# EAGLE design modular-main (EAGLE 9.2.2)
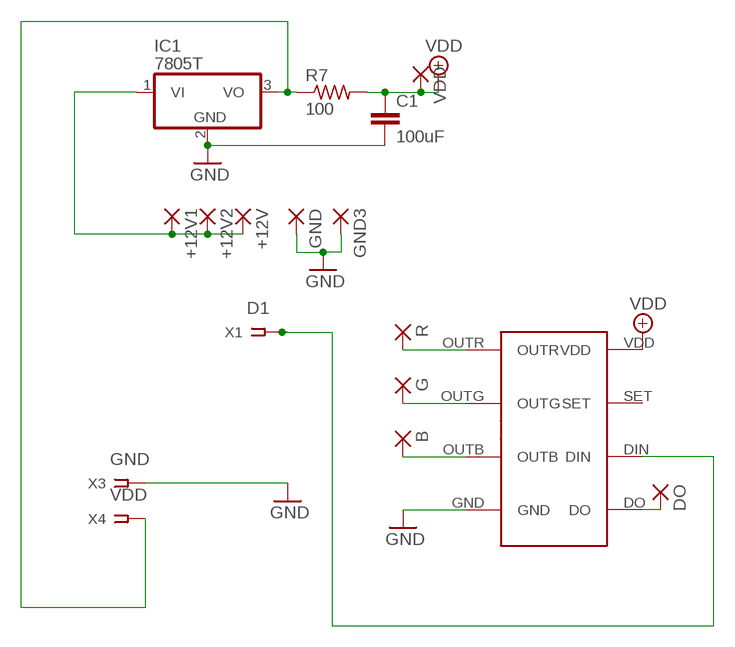
[diagram p0: schematic, sheet 1]

## Parts
0  WS2811  [SOP8]
+12V  SMD5  [SMD2,54-5,08]
+12V1  SMD5  [SMD2,54-5,08]
+12V2  SMD5  [SMD2,54-5,08]
B  SMD5  [SMD2,54-5,08]
C1  100uF  C-EUC0805  [C0805]
DO  SMD5  [SMD2,54-5,08]
G  SMD5  [SMD2,54-5,08]
GND  SMD5  [SMD2,54-5,08]
GND3  SMD5  [SMD2,54-5,08]
IC1  7805T  [TO220H]
R  SMD5  [SMD2,54-5,08]
R7  100  R-US_R0805  [R0805]
VDD  SMD5  [SMD2,54-5,08]
X1  D1  SSW-101-02-G-S  [SSW-101-02-G-S]
X3  GND  SSW-101-02-G-S  [SSW-101-02-G-S]
X4  VDD  SSW-101-02-G-S  [SSW-101-02-G-S]

## Nets
+5V: 0.VDD C1.1 R7.2 VDD.1(P) ; supply symbol labelled VDD
GND: 0.GND C1.2 GND3.1(P) GND.1(P) IC1.2(GND) X3.1
N$1: 0.DIN X1.1
N$2: 0.DO DO.1(P)
N$3: 0.OUTB B.1(P)
N$4: 0.OUTG G.1(P)
N$5: 0.OUTR R.1(P)
N$28: IC1.3(VO) R7.1 X4.1
N$29: +12V1.1(P) +12V2.1(P) +12V.1(P) IC1.1(VI)
Unconnected: 0.SET

## Library data of the parts
0 = ws2811:WS2811
+12V +12V1 +12V2 B DO G GND GND3 R VDD = wirepad:SMD5: SMD PAD
C1 = rcl:C-EU: CAPACITOR, European symbol; SPICEPREFIX: C
IC1 = linear:78*: Positive VOLTAGE REGULATOR Source: http://cache.national.com/ds/LM/LM78L05.pdf http://www.fairchildsemi.com/ds/LM/LM7805.pdf
R7 = rcl:R-US_: RESISTOR, American symbol; SPICEPREFIX: R
X1 X3 X4 = con-samtec:SSW-101-02-G-S: THROUGH-HOLE .025" SQ POST SOCKET Source: Samtec SSW.pdf; MF: Samtec Inc.; MPN: SSW-101-02-G-S; OC_FARNELL: unknown; OC_NEWARK: 11P9336

## Board
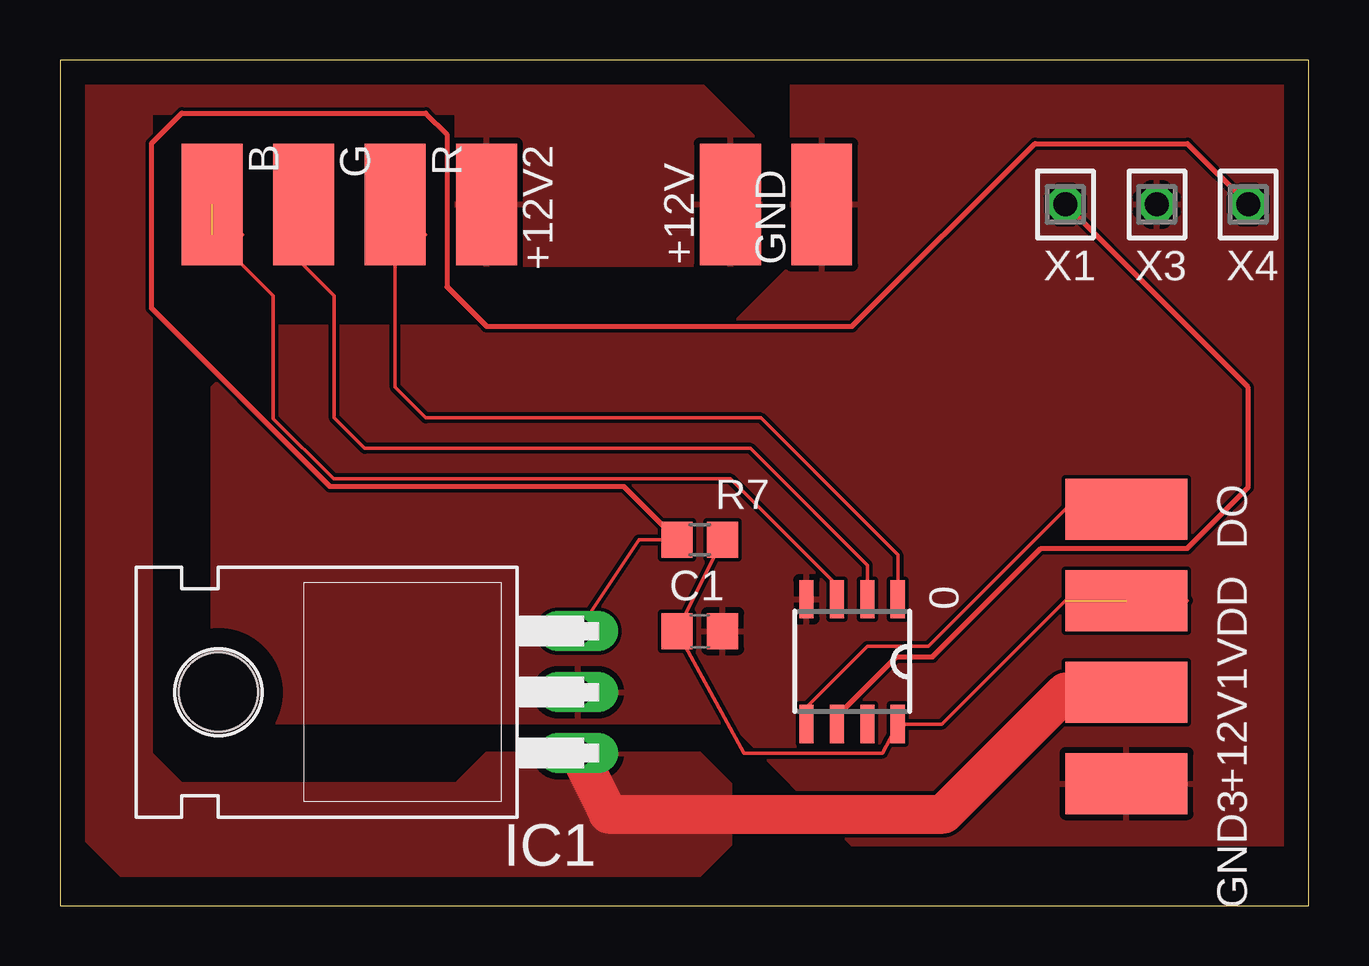
[diagram p1: board, top side]

Size 52.05 x 35.23 mm. Coordinates in mm from the lower left corner, seen from the top.
Outline: 0,0 52.05,0 52.05,35.23 0,35.23 0,0
Copper layers (1*16): Top 0.035mm / dielectric 1.5mm / Bottom 0.035mm
Design rules "default": minimum track width 6mil, minimum drill 0.35mm, track to track 6mil, track to pad 6mil, pad to pad 6mil, via to via 6mil, smd to smd 6mil, copper to edge 40mil, drill to drill 6mil, minimum pad ring 10mil, minimum via ring 8mil, stop-mask expansion 4mil, vias tented up to drill 0mil, thermal gap 10mil

### Footprints (pad centres in the part's own frame; a part is rotated, then mirrored left to right if it is on the bottom)
SOP8 = smd 0.6 x 1.6: DIN 0.635,2.6; DO 1.905,2.6; GND 1.905,-2.6; OUTB 0.635,-2.6; OUTG -0.635,-2.6; OUTR -1.905,-2.6; SET -0.635,2.6; VDD -1.905,2.6
SMD2,54-5,08 = smd 2.54 x 5.08: 1 0,0
C0805 = smd 1.3 x 1.5: 1 -0.95,0; 2 0.95,0
TO220H = drill 1.118 long: 1 -2.54,-10.16; 2 0,-10.16; 3 2.54,-10.16 | hole 3.302: 0,4.826
R0805 = smd 1.3 x 1.5: 1 -0.95,0; 2 0.95,0
SSW-101-02-G-S = drill 1 pad 1.5 octagon: 1 0,0

### Placement (x,y rotation side)
0  33.02,10.16 180 top
+12V  27.94,29.21 0 top
+12V1  44.45,8.89 90 top
+12V2  17.78,29.21 180 top
B  6.35,29.21 180 top
C1  26.67,11.43 0 top
DO  44.45,16.51 90 top
G  10.16,29.21 180 top
GND  31.75,29.21 0 top
GND3  44.45,5.08 90 top
IC1  11.43,8.89 90 top
R  13.97,29.21 180 top
R7  26.67,15.24 0 top
VDD  44.45,12.7 90 top
X1  41.91,29.21 90 top
X3  45.72,29.21 90 top
X4  49.53,29.21 90 top

### Tracks (layer width: path | path; a pad name or v marks a point on that pad's centre or on a via)
+5V  (1 unrouted)
  Top 0.152: 46.99,12.7 VDD.1 | 41.91,12.7 36.77,7.56 0.VDD 34.29,6.35 28.51,6.35 C1.1 R7.2
GND
  pour Top: 30.48,36.83 30.48,26.67 27.94,24.13 8.89,24.13 6.35,21.59 6.35,8.89 7.62,7.62 27.94,7.62 33.02,2.54 55.88,2.54 55.88,39.37 33.02,39.37
N$1
  Top 0.203: 0.DIN 32.38,7.89 34.85,10.36 36.37,10.36 40.89,14.88 46.99,14.88 47.09,14.99 49.53,17.42 49.53,21.59 X1.1
N$2
  Top 0.152: DO.1 41.91,16.51 36.2,10.8 33.65,10.8 31.11,8.25 0.DO 31.18,7.62
N$3  (1 unrouted)
  Top 0.152: B.1 7.62,27.94 | 0.OUTB 32.38,13.34 27.94,17.78 11.4,17.78 8.89,20.29 8.89,25.4 6.35,27.94
N$4
  Top 0.152: 0.OUTG 33.65,14.18 28.79,19.05 12.7,19.05 11.43,20.32 11.43,25.4 10.16,26.67 G.1
N$5
  Top 0.152: 15.24,27.94 R.1 13.97,27.94 13.97,26.67 13.97,21.59 15.24,20.32 29.21,20.32 34.92,14.61 0.OUTR
N$28
  Top 0.152: IC1.3 24.13,15.24 R7.1
  Top 0.203: R7.1 23.51,17.45 11.26,17.45 3.81,24.9 3.81,31.75 5.08,33.02 15.24,33.02 16.13,32.13 16.13,25.78 17.78,24.13 33.02,24.13 40.64,31.75 46.99,31.75 X4.1
N$29
  Top 1.626: IC1.1 22.86,3.81 36.83,3.81 41.91,8.89 +12V1.1
  pour Top: 29.21,31.75 29.21,26.67 16.51,26.67 16.51,33.02 3.81,33.02 3.81,6.35 5.08,5.08 16.51,5.08 17.78,6.35 26.67,6.35 27.94,5.08 27.94,2.54 26.67,1.27 2.54,1.27 -1.27,5.08 -1.27,35.56 0,36.83 24.13,36.83